# EAGLE design registers_manual3_2reg_newer (EAGLE 9.5.2)
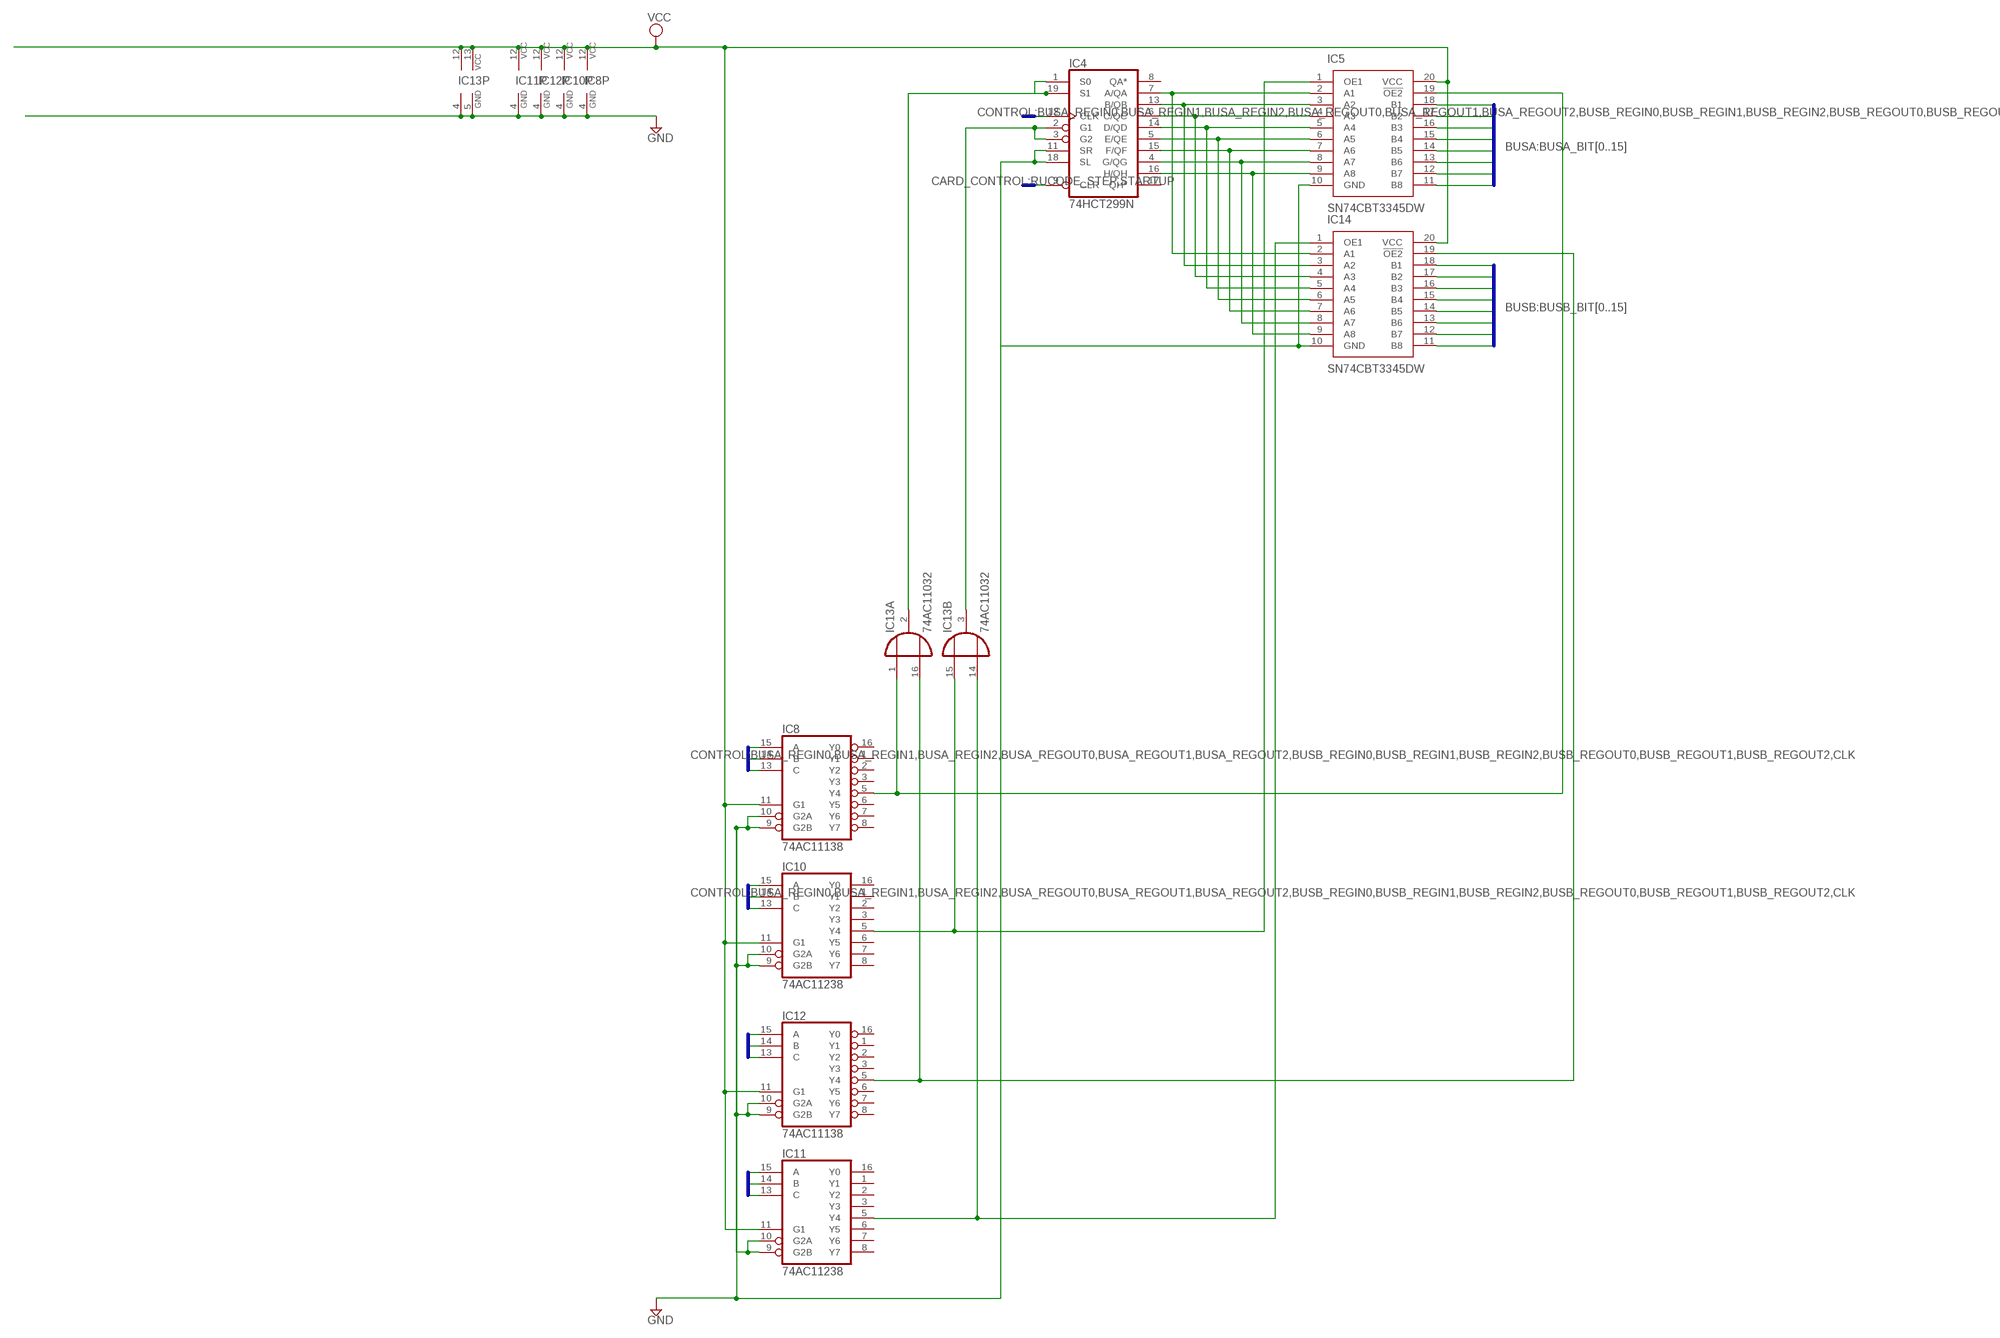
[diagram p0: schematic, sheet 1]

## Parts
IC4  74HCT299N  [DIL20]
IC5  SN74CBT3345DW  [SOIC127P1030X265-20N]
IC8  74AC11138  [DIL16]
IC10  74AC11238  [DIL16]
IC11  74AC11238  [DIL16]
IC12  74AC11138  [DIL16]
IC13  74AC11032  [DIL16]
IC14  SN74CBT3345DW  [SOIC127P1030X265-20N]

## Nets
BUSA_BIT0: IC5.18(B1)
BUSA_BIT1: IC5.17(B2)
BUSA_BIT2: IC5.16(B3)
BUSA_BIT3: IC5.15(B4)
BUSA_BIT4: IC5.14(B5)
BUSA_BIT5: IC5.13(B6)
BUSA_BIT6: IC5.12(B7)
BUSA_BIT7: IC5.11(B8)
BUSA_REGIN0: IC8.15(A)
BUSA_REGIN1: IC8.14(B)
BUSA_REGIN2: IC8.13(C)
BUSA_REGOUT0: IC10.15(A)
BUSA_REGOUT1: IC10.14(B)
BUSA_REGOUT2: IC10.13(C)
BUSB_BIT0: IC14.18(B1)
BUSB_BIT1: IC14.17(B2)
BUSB_BIT2: IC14.16(B3)
BUSB_BIT3: IC14.15(B4)
BUSB_BIT4: IC14.14(B5)
BUSB_BIT5: IC14.13(B6)
BUSB_BIT6: IC14.12(B7)
BUSB_BIT7: IC14.11(B8)
BUSB_REGIN0: IC12.15(A)
BUSB_REGIN1: IC12.14(B)
BUSB_REGIN2: IC12.13(C)
BUSB_REGOUT0: IC11.15(A)
BUSB_REGOUT1: IC11.14(B)
BUSB_REGOUT2: IC11.13(C)
CLK: IC4.12(CLK)
GND: IC4.11(SR) IC4.18(SL) IC5.10(GND) IC8.4(GND) IC8.9(G2B) IC8.10(G2A) IC10.4(GND) IC10.9(G2B) IC10.10(G2A) IC11.4(GND) IC11.9(G2B) IC11.10(G2A) IC12.4(GND) IC12.9(G2B) IC12.10(G2A) IC13.4(P:GND) IC13.5(P:GND) IC14.10(GND)
N$1: IC5.19(!OE2) IC8.5(Y4) IC13.1(A:I1)
N$15: IC4.7(A/QA) IC5.2(A1) IC14.2(A1)
N$16: IC4.13(B/QB) IC5.3(A2) IC14.3(A2)
N$17: IC4.6(C/QC) IC5.4(A3) IC14.4(A3)
N$19: IC4.2(G1) IC4.3(G2) IC13.3(B:O)
N$21: IC4.1(S0) IC4.19(S1) IC13.2(A:O)
N$22: IC4.14(D/QD) IC5.5(A4) IC14.5(A4)
N$23: IC4.5(E/QE) IC5.6(A5) IC14.6(A5)
N$24: IC4.15(F/QF) IC5.7(A6) IC14.7(A6)
N$25: IC4.4(G/QG) IC5.8(A7) IC14.8(A7)
N$28: IC4.16(H/QH) IC5.9(A8) IC14.9(A8)
N$32: IC11.5(Y4) IC13.14(B:I2) IC14.1(OE1)
N$33: IC12.5(Y4) IC13.16(A:I2) IC14.19(!OE2)
N$34: IC5.1(OE1) IC10.5(Y4) IC13.15(B:I1)
STARTUP: IC4.9(CLR)
VCC: IC5.20(VCC) IC8.11(G1) IC8.12(VCC) IC10.11(G1) IC10.12(VCC) IC11.11(G1) IC11.12(VCC) IC12.11(G1) IC12.12(VCC) IC13.12(P:VCC) IC13.13(P:VCC) IC14.20(VCC)
Unconnected: IC4.8(QA*) IC4.17(QH*) IC8.1(Y1) IC8.2(Y2) IC8.3(Y3) IC8.6(Y5) IC8.7(Y6) IC8.8(Y7) IC8.16(Y0) IC10.1(Y1) IC10.2(Y2) IC10.3(Y3) IC10.6(Y5) IC10.7(Y6) IC10.8(Y7) IC10.16(Y0) IC11.1(Y1) IC11.2(Y2) IC11.3(Y3) IC11.6(Y5) IC11.7(Y6) IC11.8(Y7) IC11.16(Y0) IC12.1(Y1) IC12.2(Y2) IC12.3(Y3) IC12.6(Y5) IC12.7(Y6) IC12.8(Y7) IC12.16(Y0) IC13.6(C:O) IC13.7(D:O) IC13.8(D:I2) IC13.9(D:I1) IC13.10(C:I2) IC13.11(C:I1)

## Buses
CONTROL:BUSA_REGIN0,BUSA_REGIN1,BUSA_REGIN2,BUSA_REGOUT0,BUSA_REGOUT1,BUSA_REGOUT2,BUSB_REGIN0,BUSB_REGIN1,BUSB_REGIN2,BUSB_REGOUT0,BUSB_REGOUT1,BUSB_REGOUT2,CLK
CARD_CONTROL:RUCODE_STEP,STARTUP
BUSA:BUSA_BIT[0..15]
BUSB:BUSB_BIT[0..15]

## Power pins joined to a net without a drawn wire
GND: IC4.10(GND)
VCC: IC4.20(VCC)

## Library data of the parts
IC4 = 74xx-eu:74*299: 8-bit universal SHIFT/STORAGE REGISTER
IC5 IC14 = SamacSys_Parts:SN74CBT3345DW: Texas Instruments SN74CBT3345DW, Bus Switch, 8 x 1:1, 4.5 5.5 V, 20-Pin SOIC Source: Datasheet <https://www.ti.com/lit/ds/symlink/sn74cbt3345.pdf>; DESCRIPTION: Texas Instruments SN74CBT3345DW, Bus Switch, 8 x 1:1, 4.5 5.5 V, 20-Pin SOIC; HEIGHT: 2.65mm; MANUFACTURER_NAME: Texas Instruments; MANUFACTURER_PART_NUMBER: SN74CBT3345DW
IC8 IC12 = 74ac-logic:74AC11138: 3 to 8 line DECODER/DEMULTIPLEXER
IC10 IC11 = 74ac-logic:74AC11238: 3 to 8 line DECODER/DEMULTIPLEXER
IC13 = 74ac-logic:74AC11032: Quadruple 2-input OR

## Board
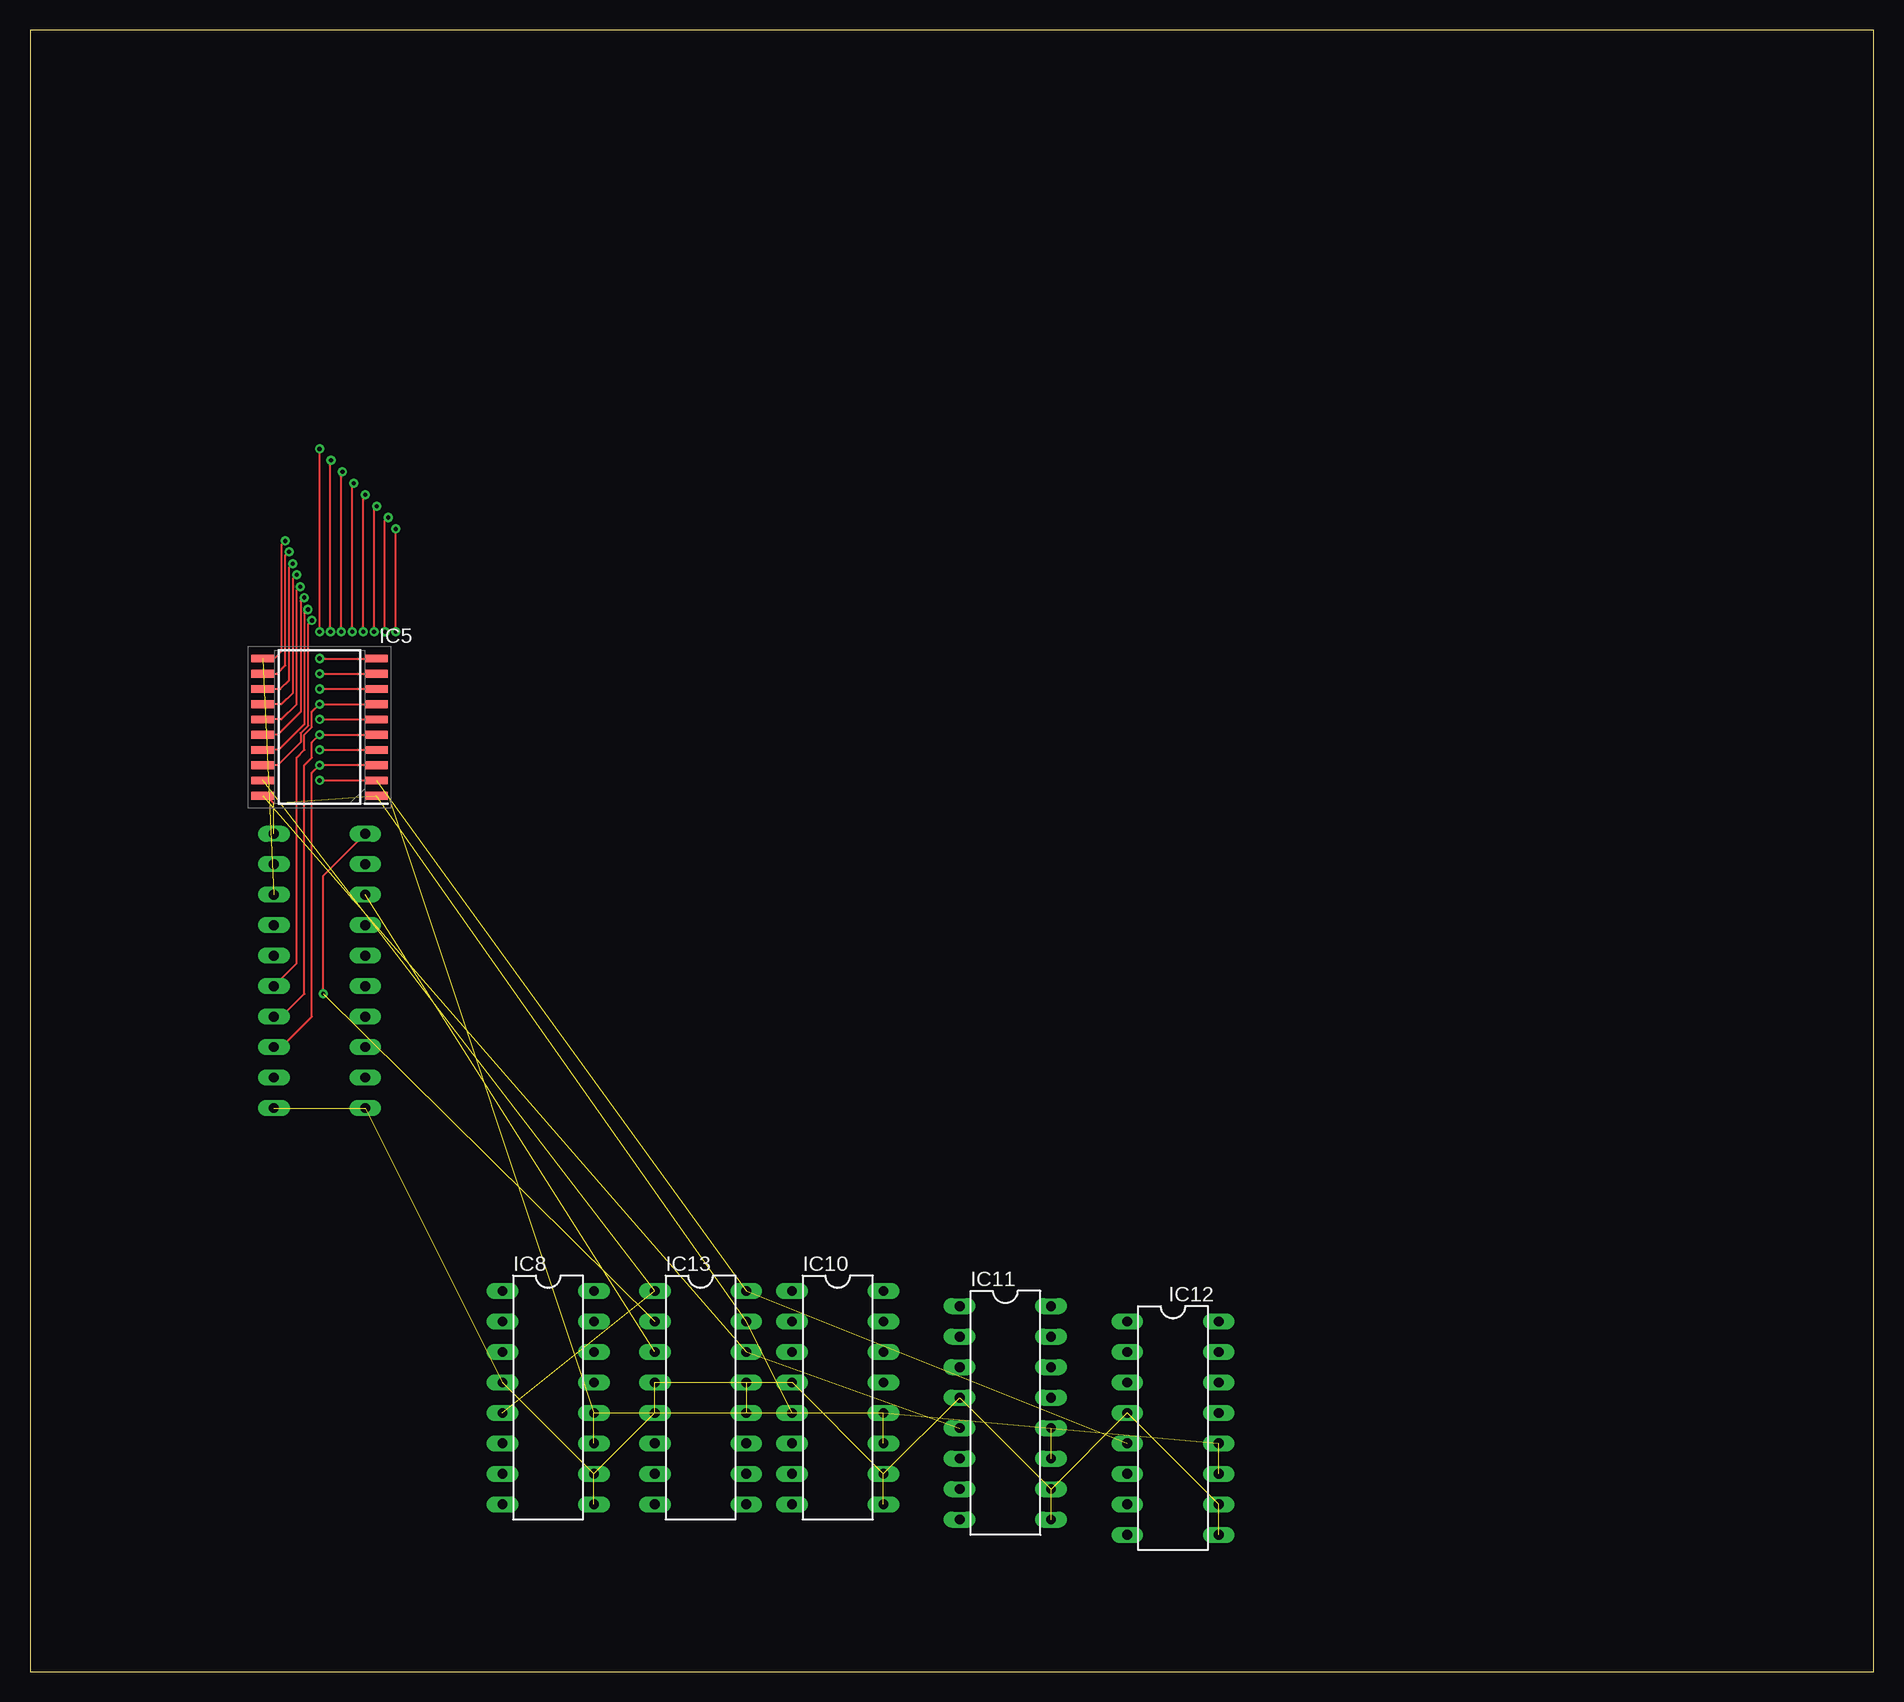
[diagram p1: board, top side]
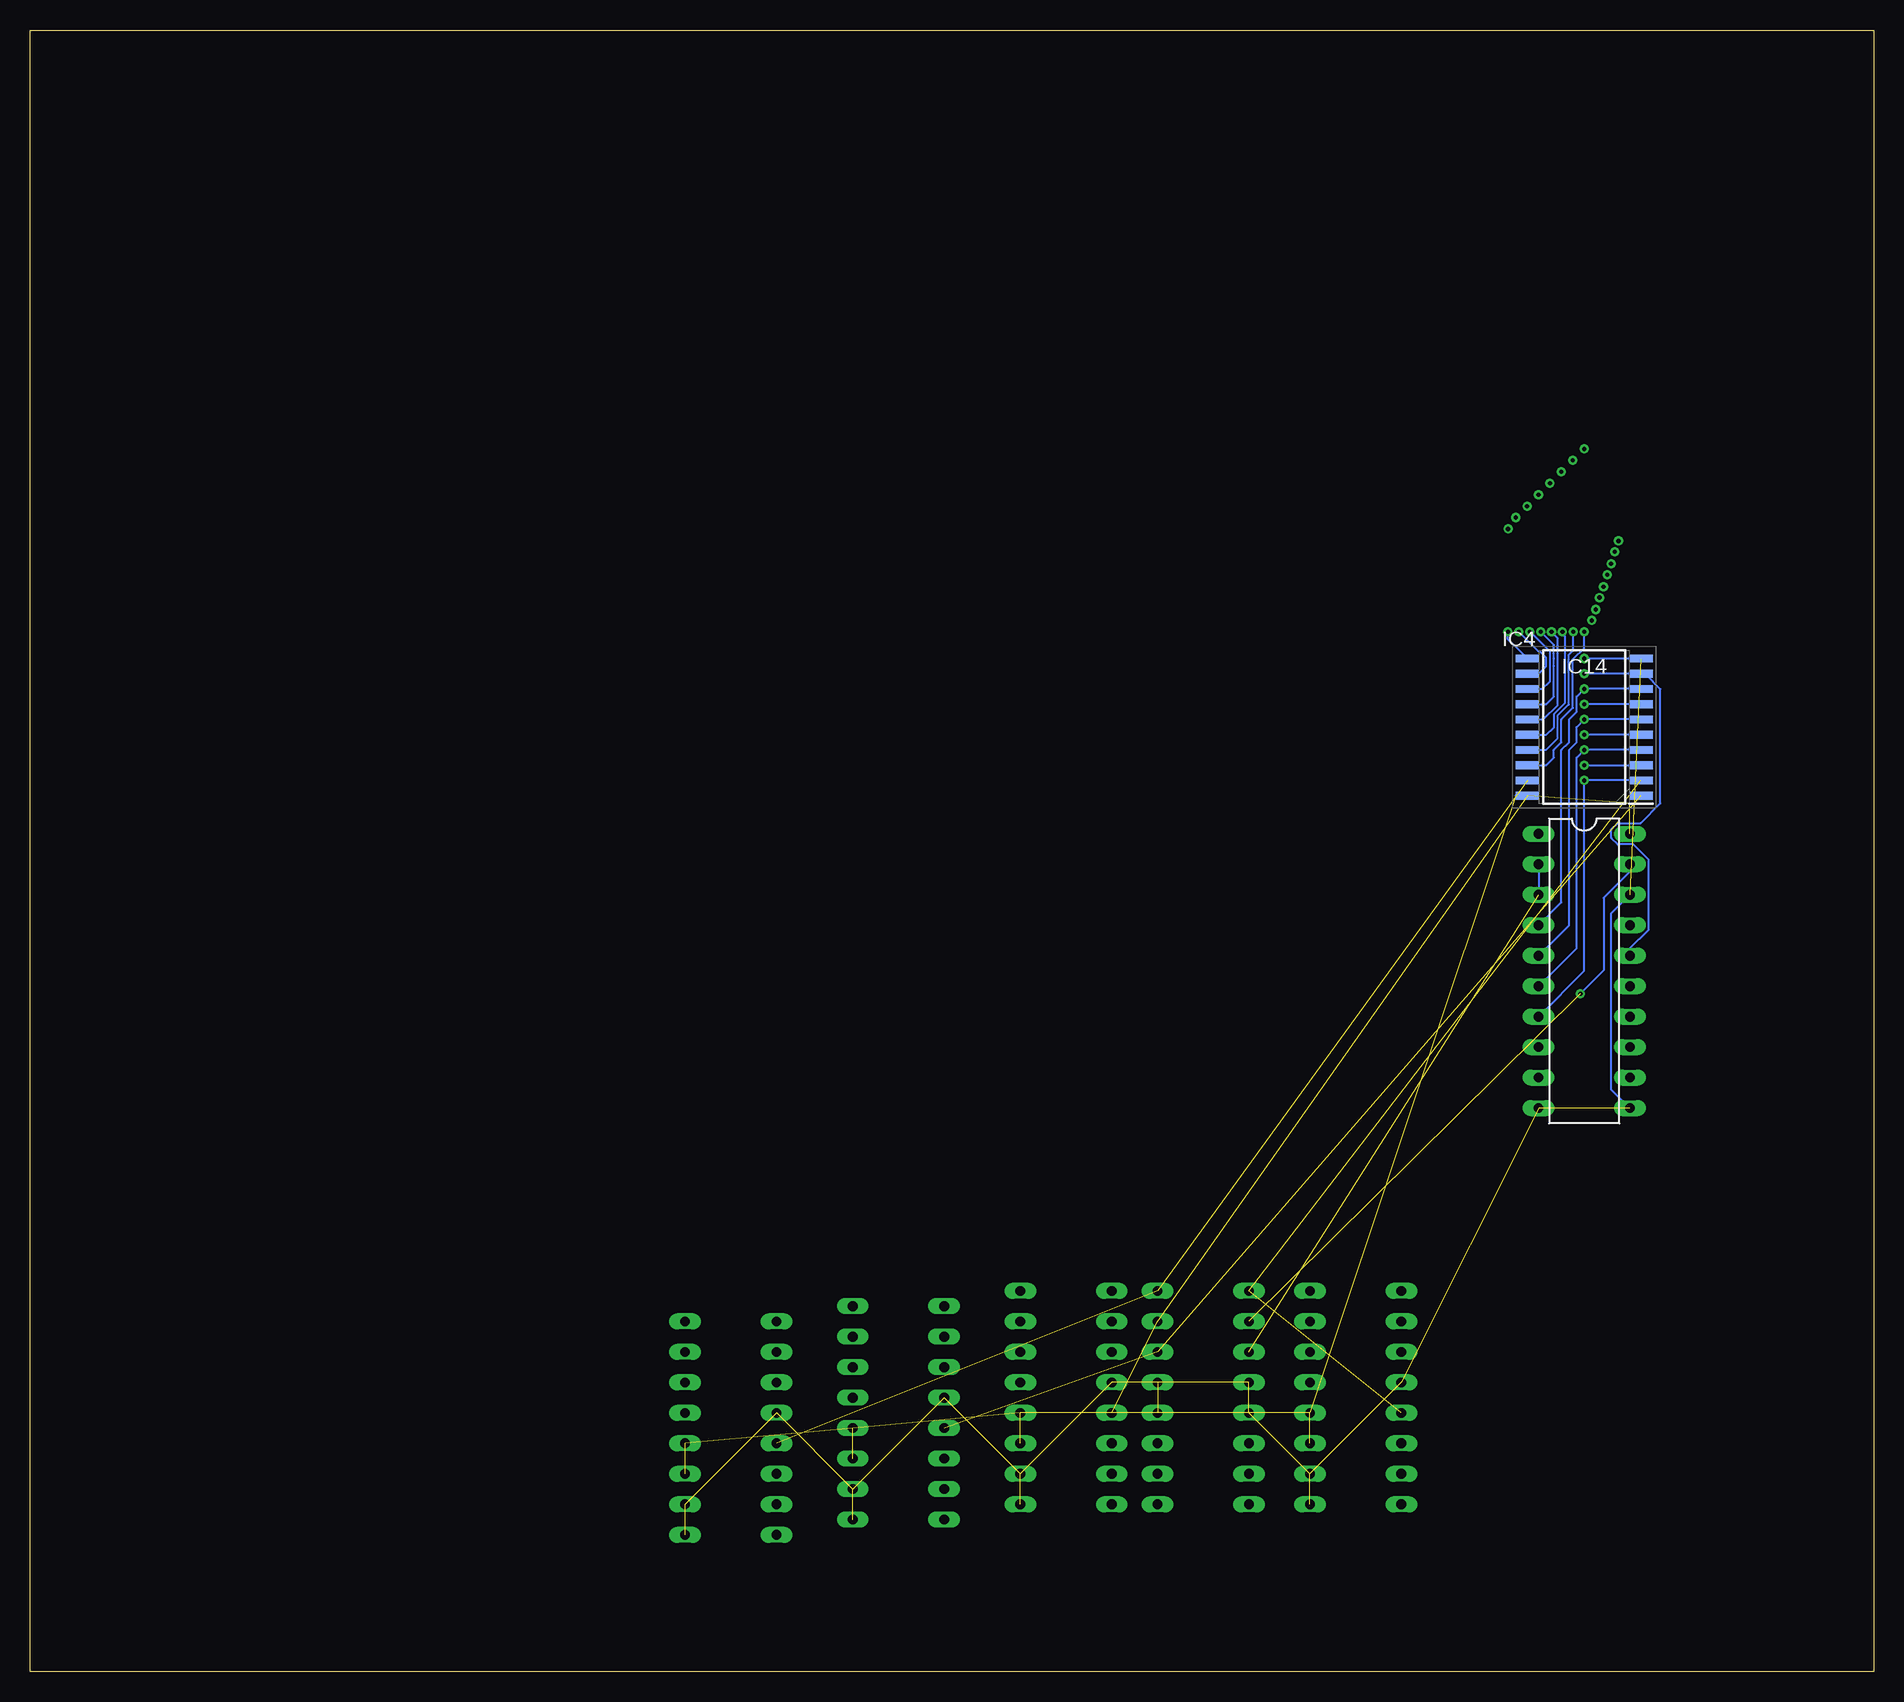
[diagram p2: board, bottom side, seen from below]

Size 153.65 x 136.83 mm. Coordinates in mm from the lower left corner, seen from the top.
Outline: 0,0 153.65,0 153.65,136.83 0,136.83 0,0
Copper layers (1*16): Top 0.035mm / dielectric 1.5mm / Bottom 0.035mm
Design rules "default *": minimum track width 6mil, minimum drill 0.35mm, track to track 6mil, track to pad 6mil, pad to pad 6mil, via to via 6mil, smd to smd 6mil, copper to edge 40mil, drill to drill 6mil, minimum pad ring 10mil, minimum via ring 8mil, stop-mask expansion 4mil, vias tented up to drill 0mil, thermal gap 10mil

### Footprints (pad centres in the part's own frame; a part is rotated, then mirrored left to right if it is on the bottom)
DIL20 = drill 0.813 long: 1 -11.43,-3.81; 2 -8.89,-3.81; 3 -6.35,-3.81; 4 -3.81,-3.81; 5 -1.27,-3.81; 6 1.27,-3.81; 7 3.81,-3.81; 8 6.35,-3.81; 9 8.89,-3.81; 10 11.43,-3.81; 11 11.43,3.81; 12 8.89,3.81; 13 6.35,3.81; 14 3.81,3.81; 15 1.27,3.81; 16 -1.27,3.81; 17 -3.81,3.81; 18 -6.35,3.81; 19 -8.89,3.81; 20 -11.43,3.81
SOIC127P1030X265-20N = smd 1.95 x 0.65: 1 -4.725,5.715; 2 -4.725,4.445; 3 -4.725,3.175; 4 -4.725,1.905; 5 -4.725,0.635; 6 -4.725,-0.635; 7 -4.725,-1.905; 8 -4.725,-3.175; 9 -4.725,-4.445; 10 -4.725,-5.715; 11 4.725,-5.715; 12 4.725,-4.445; 13 4.725,-3.175; 14 4.725,-1.905; 15 4.725,-0.635; 16 4.725,0.635; 17 4.725,1.905; 18 4.725,3.175; 19 4.725,4.445; 20 4.725,5.715
DIL16 = drill 0.813 long: 1 -8.89,-3.81; 2 -6.35,-3.81; 3 -3.81,-3.81; 4 -1.27,-3.81; 5 1.27,-3.81; 6 3.81,-3.81; 7 6.35,-3.81; 8 8.89,-3.81; 9 8.89,3.81; 10 6.35,3.81; 11 3.81,3.81; 12 1.27,3.81; 13 -1.27,3.81; 14 -3.81,3.81; 15 -6.35,3.81; 16 -8.89,3.81

### Placement (x,y rotation side)
IC4  24.13,58.42 270 bottom
IC5  24.13,78.74 180 top
IC8  43.18,22.86 270 top
IC10  67.31,22.86 270 top
IC11  81.28,21.59 270 top
IC12  95.25,20.32 270 top
IC13  55.88,22.86 270 top
IC14  24.13,78.74 180 bottom

### Tracks (layer width: path | path; a pad name or v marks a point on that pad's centre or on a via)
BUSA_BIT0  (via drill 0.35)
  Top 0.152: IC5.18 20.65,75.56 22.55,77.47 22.55,78.23 23.19,78.87 23.19,87.33 v23.5,87.63
BUSA_BIT1  (via drill 0.35)
  Top 0.152: IC5.17 20.73,76.83 22.86,78.97 22.86,88.24 v23.16,88.54
BUSA_BIT2  (via drill 0.35)
  Top 0.152: IC5.16 20.65,78.11 22.55,80.01 22.55,89.23 v22.86,89.53
BUSA_BIT3  (via drill 0.35)
  Top 0.152: IC5.15 20.95,79.38 22.23,80.64 22.23,90.14 v22.53,90.44
BUSA_BIT4  (via drill 0.35)
  Top 0.152: IC5.14 19.55,80.78 19.68,80.64 20.95,80.64 21.92,81.61 21.92,91.14 v22.23,91.44
BUSA_BIT5  (via drill 0.35)
  Top 0.152: IC5.13 20.87,81.92 21.59,82.63 21.59,92.05 v21.89,92.35
BUSA_BIT6  (via drill 0.35)
  Top 0.152: IC5.12 20.6,83.19 21.29,83.87 21.29,93.04 v21.59,93.34
BUSA_BIT7  (via drill 0.35)
  Top 0.152: IC5.11 20.34,84.45 20.98,85.09 20.98,93.96 v21.27,94.25
BUSB_BIT0  (via drill 0.35)
  Top 0.152: v24.13,86.68 v24.13,101.92
  Bottom 0.152: IC14.18 27.3,75.56 26.67,76.2 26.67,76.83 26.04,77.47 26.04,79.38 25.07,80.34 25.07,84.37 24.13,85.31 v24.13,86.68
BUSB_BIT1  (via drill 0.35)
  Top 0.152: v25.04,86.68 25.04,100.92 v25.08,100.97
  Bottom 0.152: IC14.17 27.3,76.83 26.34,77.8 26.34,79.7 25.41,80.63 25.41,84.77 25.09,85.09 25.08,85.09 25.04,85.13 v25.04,86.68
BUSB_BIT2  (via drill 0.35)
  Top 0.152: v25.95,86.68 25.95,99.92 v26.04,100.01
  Bottom 0.152: IC14.16 27.28,78.11 26.64,78.74 26.64,79.83 25.72,80.76 25.72,86.27 25.95,86.5 v25.95,86.68
BUSB_BIT3  (via drill 0.35)
  Top 0.152: v26.86,86.68 26.86,98.93 v26.99,99.06
  Bottom 0.152: IC14.15 27.53,79.38 26.34,80.57 26.34,86.16 v26.86,86.68
BUSB_BIT4  (via drill 0.35)
  Top 0.152: v27.77,86.68 27.77,97.93 v27.94,98.11
  Bottom 0.152: IC14.14 27.3,80.64 26.67,81.28 26.67,83.82 26.67,84.45 26.67,85.58 v27.77,86.68
BUSB_BIT5  (via drill 0.35)
  Top 0.152: v28.67,86.68 28.67,96.94 v28.89,97.16
  Bottom 0.152: IC14.13 27.61,81.92 26.98,82.55 26.98,85.03 28.62,86.68 v28.67,86.68
BUSB_BIT6  (via drill 0.35)
  Top 0.152: v29.58,86.68 29.58,95.94 v29.84,96.2
  Bottom 0.152: IC14.12 27.94,83.19 27.3,83.82 27.3,84.53 27.79,85.01 27.91,85.01 v29.58,86.68
BUSB_BIT7  (via drill 0.35)
  Top 0.152: v30.49,86.68 v30.48,86.69 v30.48,95.25
  Bottom 0.152: 29.62,85.22 IC14.11 30.12,85.72 30.16,85.72 30.49,86.05 v30.49,86.68
GND  (via drill 0.35)  (16 unrouted)
  Top 0.152: v24.13,84.45 IC5.10
  Bottom 0.152: IC4.18 21.91,63.18 21.91,48.58 IC4.11 | IC14.10 v24.13,84.45
N$1  (2 unrouted)
N$15  (via drill 0.35)
  Top 0.152: v24.13,74.3 IC5.2
  Bottom 0.152: IC14.2 v24.13,74.3 24.13,58.42 IC4.7
N$16  (via drill 0.35)
  Top 0.152: IC5.3 v24.13,75.56 23.5,74.93 23.5,54.61 20.95,52.07 IC4.13
  Bottom 0.152: v24.13,75.56 IC14.3
N$17  (via drill 0.35)
  Top 0.152: v24.13,76.83 IC5.4
  Bottom 0.152: IC14.4 v24.13,76.83 24.77,76.2 24.77,60.33 IC4.6
N$19  (1 unrouted)
  Bottom 0.152: IC4.2 IC4.3
N$21  (via drill 0.35)  (1 unrouted)
  Top 0.152: v24.45,56.52 24.45,66.36 IC4.1
  Bottom 0.152: IC4.19 20.32,66.69 22.5,64.5 22.5,58.46 v24.45,56.52
N$22  (via drill 0.35)
  Top 0.152: IC5.5 v24.13,78.11 23.5,77.47 23.5,76.2 22.86,75.56 22.86,56.52 20.95,54.61 IC4.14
  Bottom 0.152: IC14.5 v24.13,78.11
N$23  (via drill 0.35)
  Top 0.152: v24.13,79.38 IC5.6
  Bottom 0.152: IC14.6 v24.13,79.38 24.77,78.74 24.77,77.47 25.4,76.83 25.4,62.23 IC4.5
N$24  (via drill 0.35)
  Top 0.152: IC5.7 v24.13,80.64 23.5,80.01 23.5,78.74 22.86,78.11 22.86,76.83 22.23,76.2 22.23,59.05 IC4.15
  Bottom 0.152: IC14.7 v24.13,80.64
N$25  (via drill 0.35)
  Top 0.152: v24.13,81.92 IC5.8
  Bottom 0.152: IC14.8 v24.13,81.92 24.77,81.28 24.77,80.01 25.4,79.38 25.4,77.47 26.04,76.83 26.04,64.14 IC4.4
N$28  (via drill 0.35)
  Top 0.152: v24.13,83.19 IC5.9
  Bottom 0.152: v24.13,83.19 IC14.9 19.05,83.19 17.78,81.91 17.78,72.39 19.43,70.74 21.35,70.74 21.87,70.22 21.87,69.48 21.35,68.96 20.05,68.96 18.77,67.68 18.77,61.86 20.32,60.31 IC4.16
N$32  (2 unrouted)
N$33  (2 unrouted)
N$34  (2 unrouted)
VCC  (12 unrouted)
  Top 0.152: 20.32,72.39 19.68,73.03 IC5.20
  Bottom 0.152: 29.84,73.03 IC14.20